# Altium schematic sheet FTDI_USB_UART.SchDoc
size A3; SheetNumber: 2; SheetTotal: 2
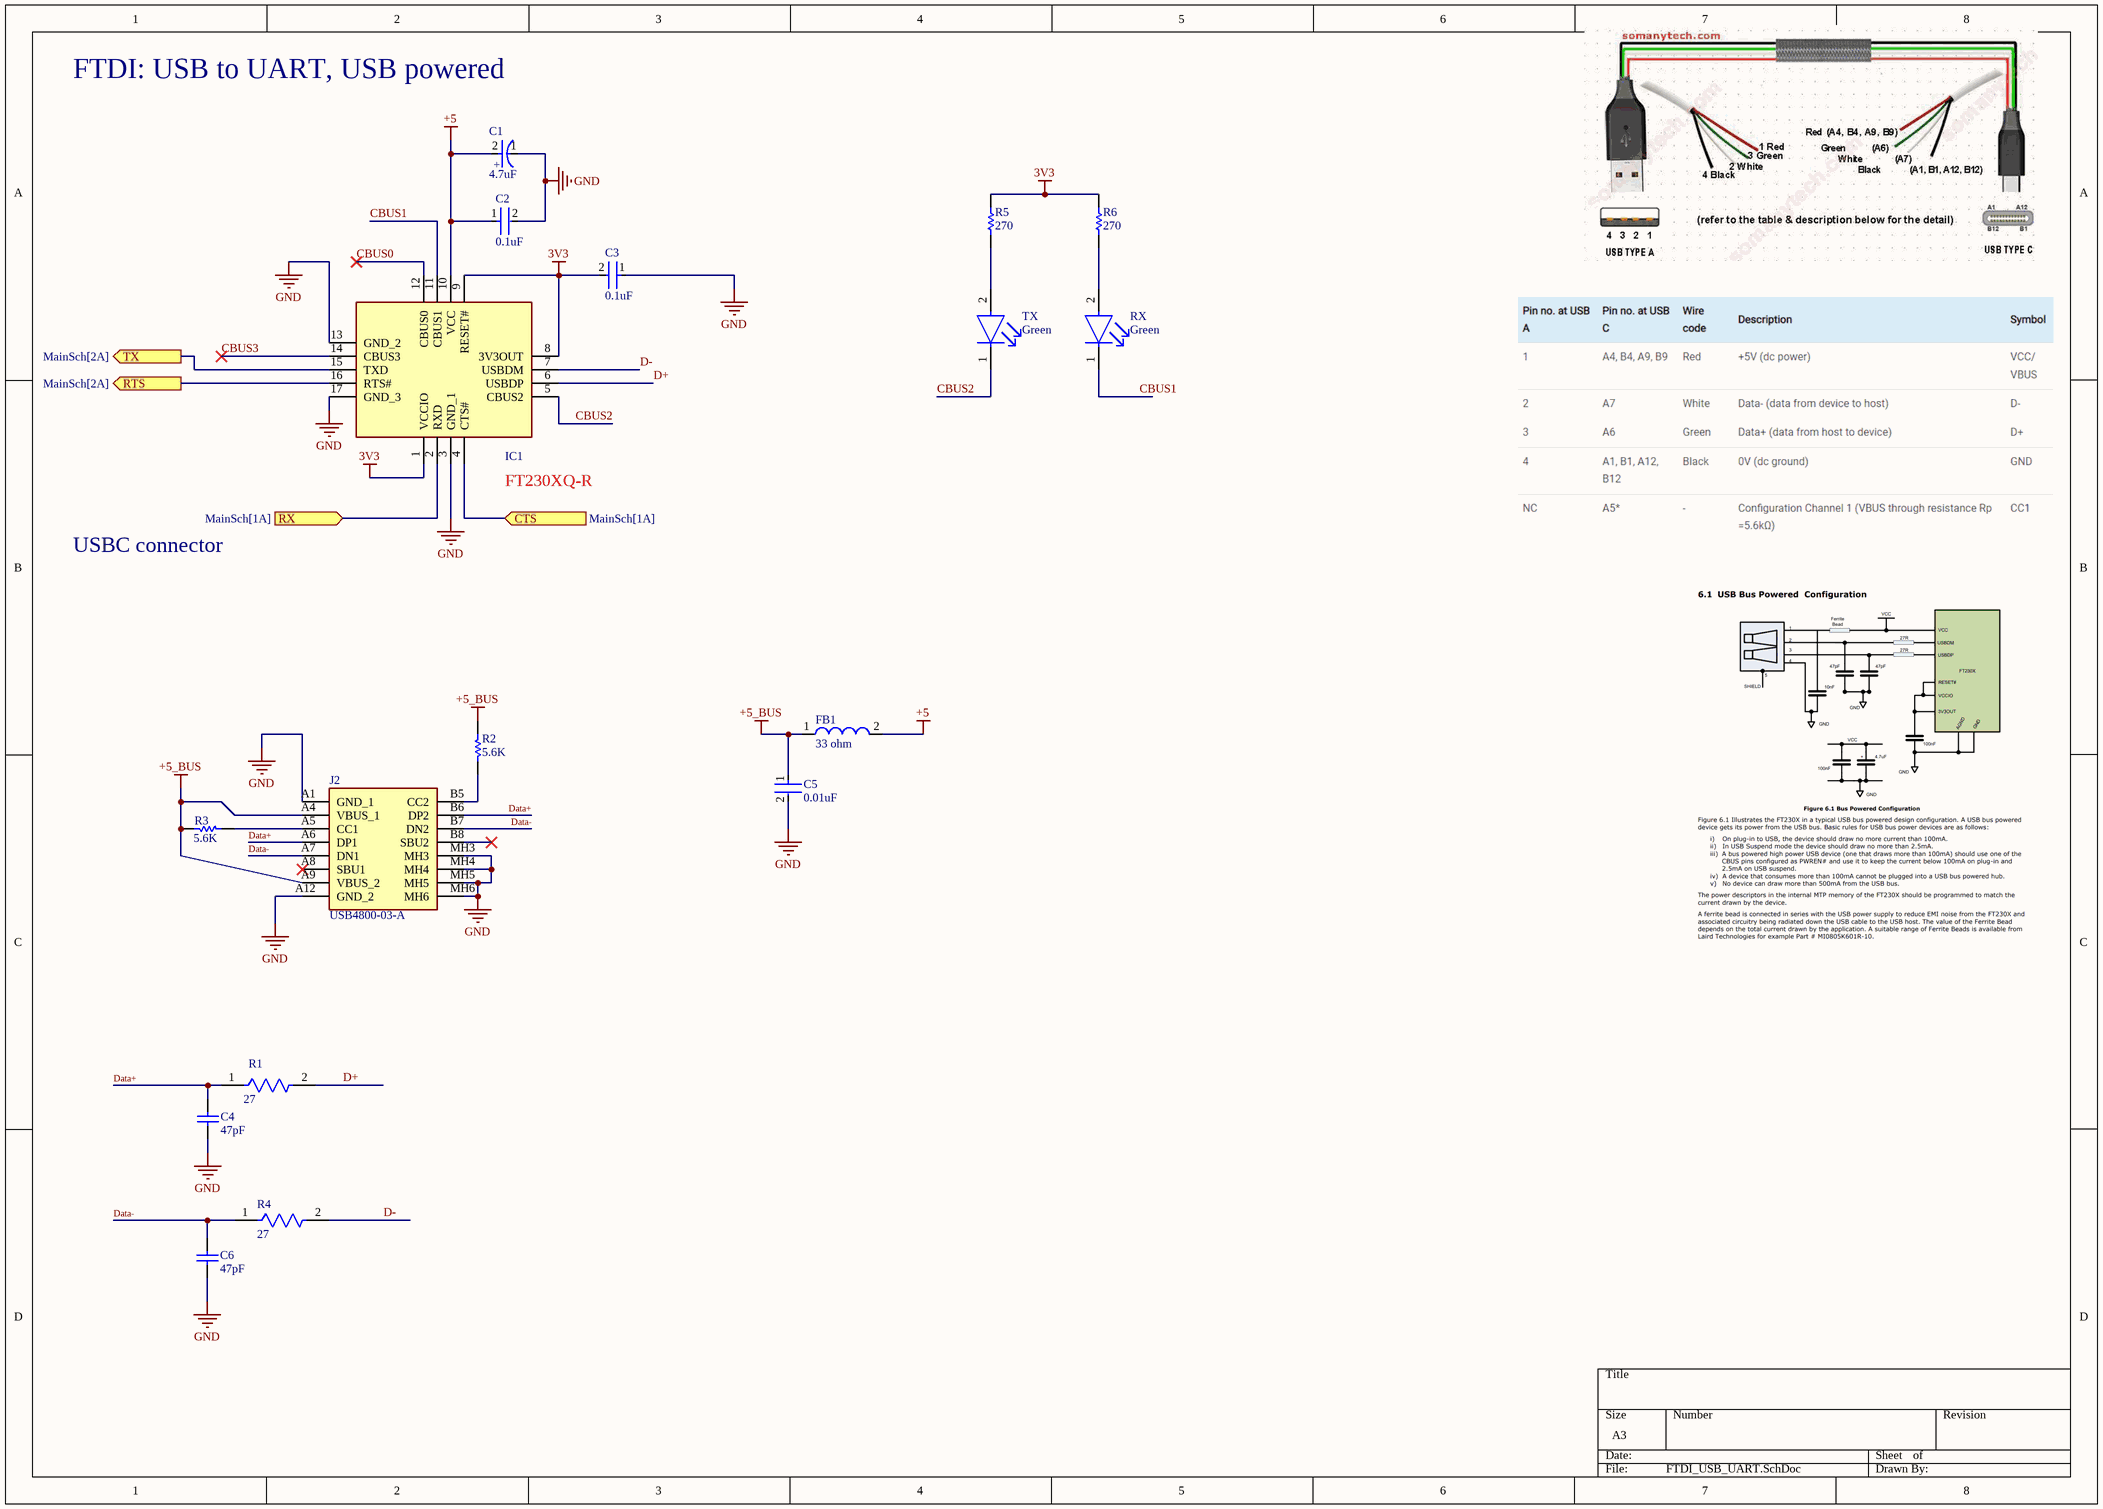
[diagram p0: FTDI_USB_UART.SchDoc]

## Parts
C1  4.7uF  [FP-RAD-TH-D_6_3_0_5-L_11-MFG]
C2  0.1uF  [FP-C0603C-CF-MFG]
C3  0.1uF  [FP-C0603C-CF-MFG]
C4  47pF  [CAPC1608X90X35NL10T15]
C5  0.01uF  [FP-CC0603-DA-MFG]
C6  47pF  [CAPC1608X90X35NL10T15]
FB1  33 ohm  [SMD-0805]
IC1  FT230XQ-R  [QFN65P400X400X80-17N]
J2  USB4800-03-A  [USB480003A]
R1  27  [FP-ERJ3EK-IPC_B]
R2  5.6K  [RESC1609X50X30NL10T20]
R3  5.6K  [RESC1609X50X30NL10T20]
R4  27  [FP-ERJ3EK-IPC_B]
R5  270  [RESC1609X50X30NL10T20]
R6  270  [RESC1609X50X30NL10T20]
RX  Green  [FP-150080SS75000-MFG]
TX  Green  [FP-150080SS75000-MFG]

## Ports
CTS (in, see MainSch[1A]), RTS (out, see MainSch[2A]), RX (in, see MainSch[1A]), TX (out, see MainSch[2A])

## Nets
3V3: C3.2 IC1.1(VCCIO) IC1.8(3V3OUT) IC1.9(RESET#) R5.2 R6.2
+5: C1.2(A) C2.1 FB1.2 IC1.10(VCC)
+5_BUS: C5.1 FB1.1 J2.A4(VBUS_1) J2.A9(VBUS_2) R2.1 R3.2
GND: C1.1(C) C2.2 C3.1 C4.1 C5.2 C6.1 IC1.3(GND_1) IC1.13(GND_2) IC1.17(GND_3) J2.A1(GND_1) J2.A12(GND_2) J2.MH3 J2.MH4 J2.MH5 J2.MH6
CBUS0: IC1.12(CBUS0)
CBUS1: IC1.11(CBUS1) RX.1(C)
CBUS2: IC1.5(CBUS2) TX.1(C)
CBUS3: IC1.14(CBUS3)
CTS: IC1.4(CTS#) ; port CTS
D+: IC1.6(USBDP) R1.2
D-: IC1.7(USBDM) R4.2
Data+: C4.2 J2.A6(DP1) J2.B6(DP2) R1.1
Data-: C6.2 J2.A7(DN1) J2.B7(DN2) R4.1
RTS: IC1.16(RTS#) ; port RTS
RX: IC1.2(RXD) ; port RX
TX: IC1.15(TXD) ; port TX
NetJ2_A5: J2.A5(CC1) R3.1
NetJ2_B5: J2.B5(CC2) R2.2
NetR5_1: R5.1 TX.2(A)
NetR6_1: R6.1 RX.2(A)

Not connected (* = marked no-connect by the designer): J2 A8(SBU1)* B8(SBU2)*

## Notes on the sheet
- FTDI: USB to UART, USB powered
- USBC connector
- (in symbol CMP-05427-000237-1) +

## Library data of the parts
C1 = CMP-05427-000237-1: Aluminum Electrolytic Capacitors (Radial Lead Type) 4.7uF ±20% 160V; Life (Hours): 2000Hour; Ripple Current: 43mA; Dielectric Material: Aluminium; Lead/Base Style: Straight; Lead Diameter: 0.5mm; Dissipation Factor: 0.15%; Height - Seated (Max): 0.48inch; Voltage: 160V; REACH SVHC: No SVHC; Package Quantity: 200; Length: 11.2mm; Termination: Radial; Weight: 0.01lb; Construction: RADIAL; Voltage Rating (DC): 160V; Number of Pins: 2; Voltage Rating: 160V; Min Operating Temperature: -25°C; Packaging: Bulk; Radiation Hardening: No; Series: NHG; Max Operating Temperature: 105°C; Height: 11.2mm; Mount: Through Hole; Tolerance: 20%; Capacitance: 4.7uF; Width: 0.25inch; Lead Pitch: 2.5mm; Diameter: 6.3mm; Ripple Current (AC): 43mA; Case/Package: Radial; Lead Free: Lead Free; RoHS Compliant: Yes
C2 C3 = CMP-2006-03061-2: CAP CER 0.1UF 50V X7R 0603; Manufacturer: KEMET; Manufacturer Part Number: C0603C104K5RACTU; Tolerance: 0.1; Temperature Coefficient: 30ppm/°C; Material: Ceramic; Automotive Grade: Grade 1; Value: 0.10 μF; Temperature: -55°C to +125°C; RoHS: TRUE; Temperature Range High: +125°C; Lead Free: Yes; Octopart: https://octopart.com/c0603c104k5ractu-kemet-139244; Digikey Description: CAP CER 0.1UF 50V X7R 0603; Category: Cap; Package: C0603C-CF; ComponentLink2Description: Datasheet; Temperature Range Low: -55°C; Device Class L1: Passive Components; Voltage Rating: 50 V; Automotive: Yes; Device Class L3: Ceramic Capacitors; ComponentLink2URL: https://api.kemet.com/component-edge/download/datasheet/C0603C100J5GACAUTO.pdf; Capacitance: 0.10 μF; Device Class L2: Capacitors; Temperature Characteristic: X7R; Height: 0.87mm
C4 C6 = CMP-2006-02672-1: Manufacturer: Murata; Part Number: GRM1885C1H470JA01D
C5 = CMP-2100-03600-2: CAP CER 10000PF 50V X7R 0603; Manufacturer Part Number: CC0603KRX7R9BB103; Manufacturer: YAGEO; Tolerance: 0.1; Material: Ceramic; Temperature Coefficient: 15%; Value: 10 nF; Mouser Description: Multilayer Ceramic Capacitor, CC Series, 0.01 - F, - 10%, X7R, 50 V, 0603 [1608 Metric]; Digikey Description: CAP CER 10000PF 50V X7R 0603; Height: 0.9mm; Category: Cap; Temperature Characteristic: X7R; Footprint Url: http://www.yageo.com/exep/pages/download/literatures/UPY-C_GEN_24.pdf; Lead Free: Yes; Voltage Rating: 50 V; Temperature: -55°C to +125°C; Device Class L3: Ceramic Capacitors; ComponentLink2Description: Datasheet; Voltage: 50 V; Package: CC0603-DA; Octopart: https://octopart.com/cc0603krx7r9bb103-yageo-192938; Automotive: No; Temperature Range High: +125°C; Temperature Range Low: -55°C; RoHS: TRUE; Device Class L1: Passive Components; ComponentLink2URL: http://www.yageo.com/documents/recent/UPY-GPHC_X7R_6.3V-to-50V_18.pdf; Device Class L2: Capacitors; Capacitance: 10 nF
FB1 = CMP-0220-00044-1: SMD EMI Suppression Ferrite Bead WE-CBF, Z = 33 Ohm; PackageVersion: 2005; ComponentLink1URL: http://www.we-online.com; ComponentLink1Description: Manufacturer Link; ComponentLink2Description: Datasheet; PackageDescription: Chip Inductor, 2-Leads, Body 2.0 x 1.2 mm; ComponentLink2URL: http://www.we-online.de/katalog/media/pdf/742792012.pdf; Impedance: 33 Ohm; PackageReference: SMD-0805; DatasheetVersion: Dec-2005
IC1 = FT230XQ-R: Integrated Circuit; Manufacturer_Name: FTDI Chip; Datasheet Link: https://componentsearchengine.com/Datasheets/1/FT230XQ-R.pdf; Height: 0.8mm; Manufacturer_Part_Number: FT230XQ-R; Mouser Part Number: 895-FT230XQ-R; Mouser Price/Stock: https://www.mouser.co.uk/ProductDetail/FTDI/FT230XQ-R?qs=Gp1Yz1mis3VvmXwyDmIHOg%3D%3D
J2 = USB4800-03-A: Connector; Manufacturer_Name: GCT (GLOBAL CONNECTOR TECHNOLOGY); Datasheet Link: https://gct.co/connector/usb4800; Height: 5.58mm; Manufacturer_Part_Number: USB4800-03-A; Mouser Part Number: 640-USB4800-03-A; Mouser Price/Stock: https://www.mouser.co.uk/ProductDetail/GCT/USB4800-03-A?qs=vvQtp7zwQdMkfG8vViEZoQ%3D%3D
R1 R4 = CMP-2000-00396-2: RES SMD 27 OHM 1% 1/10W 0603; Max Power Dissipation: 100mW; Resistance: 27R; Voltage Rating: 75V; Temperature Coefficient: 100ppm/°C; Number of Pins: 2; Case Code (Imperial): 0603; Resistance Tolerance: 1%; Max Operating Temperature: 155°C; Min Operating Temperature: -55°C; Termination: SMD/SMT; Length: 1.6mm; Resistor Type: Thick Film; Tolerance: 1%; Packaging: Tape and Reel; Radiation Hardening: No; Series: ERJ; Depth: 0.8mm; RoHS Compliant: Yes; Lead Free: Lead Free; Height: 0.022inch; Width: 0.031inch; Mount: Surface Mount; Contact Plating: Tin; Number of Terminations: 2; Features: Automotive AEC-Q200; Military Standard: Not; Power Rating: 100mW; Package Quantity: 1; Case/Package: 0603; Construction: Rectangular; Voltage Rating (DC): 75V; Case Code (Metric): 1608
R2 R3 R5 R6 = CMP-1012-00708-2: Part Number: CRCW060356K0FKEA; Manufacturer: Vishay Dale
RX TX = CMP-1426-00010-2: LED RED CLEAR 0805 SMD; Forward Voltage: 1.9V; Luminous Intensity: 60mcd; Dominant Wavelength: 630nm; Forward Current: 30mA; Viewing Angle: 140°; Lens Color: Colorless; Test Current: 20mA; Lens Size: 1.25mm; Packaging: Cut Tape; Width: 1.25mm; Case Code (Metric): 2012; Max Operating Temperature: 85°C; RoHS Compliant: Yes; Mount: Surface Mount; Case/Package: 0805; Series: WL-SMCW; Length: 2mm; Case Code (Imperial): 0805; Wavelength: 630nm; Lens Style: Clear; Min Operating Temperature: -40°C; Color: Red; Lens Transparency: Clear; Package Quantity: 1; Height: 0.8mm